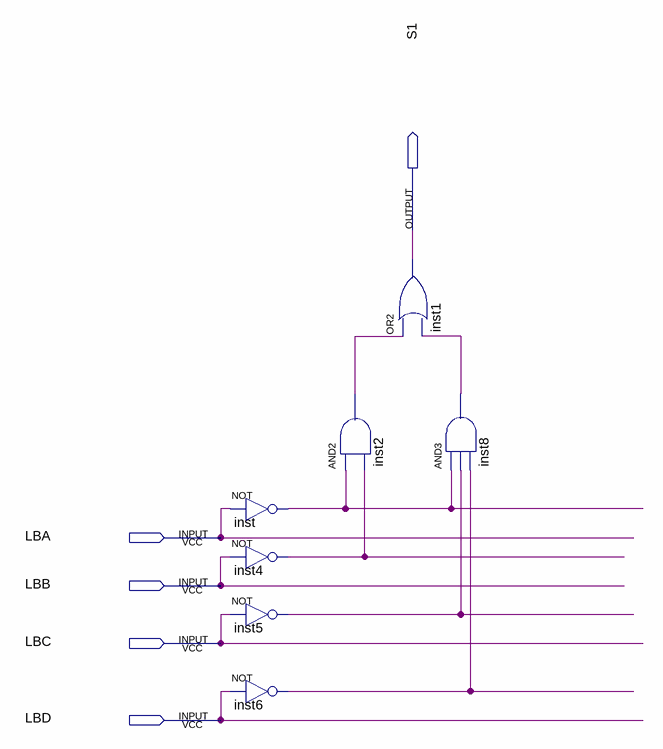
[diagram p0: schematic sheet]
// Quartus schematic Linha1.bdf as structural Verilog: 7 symbols, 5 pins
module Linha1 (
  input  LBA,
  input  LBB,
  input  LBC,
  input  LBD,
  output S1
);

  wire inst2_out, inst4_out, inst5_out, inst6_out, inst8_out, inst_out;

  not inst (inst_out, LBA);
  not inst4 (inst4_out, LBB);
  not inst5 (inst5_out, LBC);
  not inst6 (inst6_out, LBD);
  and inst2 (inst2_out, inst_out, inst4_out);
  or inst1 (S1, inst2_out, inst8_out);
  and inst8 (inst8_out, inst_out, inst5_out, inst6_out);
endmodule
